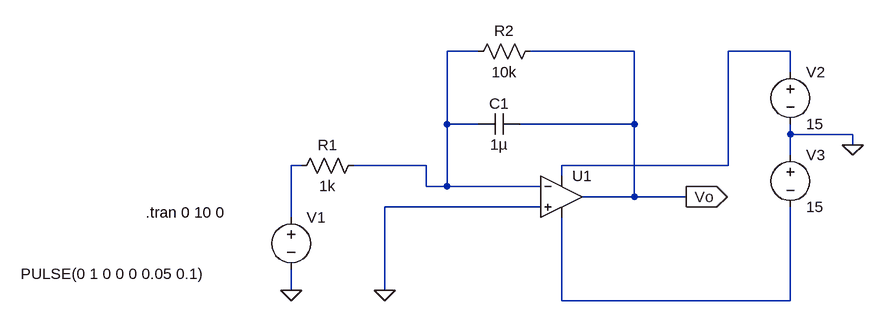
[diagram p0: schematic Integrator.asc]
Integrator.asc, the LTspice schematic file:
Version 4.1
SHEET 1 932 680
WIRE 336 -144 288 -144
WIRE 576 -144 416 -144
WIRE 816 -144 720 -144
WIRE 816 -112 816 -144
WIRE 288 -32 288 -144
WIRE 336 -32 288 -32
WIRE 576 -32 576 -144
WIRE 576 -32 400 -32
WIRE 816 -16 816 -32
WIRE 912 -16 816 -16
WIRE 912 0 912 -16
WIRE 816 16 816 -16
WIRE 64 32 48 32
WIRE 256 32 144 32
WIRE 720 32 720 -144
WIRE 720 32 464 32
WIRE 464 48 464 32
WIRE 256 64 256 32
WIRE 288 64 288 -32
WIRE 288 64 256 64
WIRE 432 64 288 64
WIRE 576 80 576 -32
WIRE 576 80 496 80
WIRE 656 80 576 80
WIRE 432 96 192 96
WIRE 48 112 48 32
WIRE 48 224 48 192
WIRE 192 224 192 96
WIRE 464 240 464 112
WIRE 816 240 816 96
WIRE 816 240 464 240
FLAG 192 224 0
FLAG 48 224 0
FLAG 656 80 Vo
IOPIN 656 80 Out
FLAG 912 0 0
SYMBOL res 160 16 R90
WINDOW 0 0 56 VBottom 2
WINDOW 3 32 56 VTop 2
SYMATTR InstName R1
SYMATTR Value 1k
SYMBOL res 432 -160 R90
WINDOW 0 0 56 VBottom 2
WINDOW 3 32 56 VTop 2
SYMATTR InstName R2
SYMATTR Value 10k
SYMBOL cap 400 -48 R90
WINDOW 0 0 32 VBottom 2
WINDOW 3 32 32 VTop 2
SYMATTR InstName C1
SYMATTR Value 1µ
SYMBOL voltage 48 96 R0
WINDOW 3 -416 103 Left 2
WINDOW 123 0 0 Left 0
WINDOW 39 0 0 Left 0
SYMATTR Value PULSE(0 1 0 0 0 0.05 0.1)
SYMATTR InstName V1
SYMBOL OpAmps\\UniversalOpAmp2 464 80 R0
SYMATTR InstName U1
SYMBOL voltage 816 -128 R0
WINDOW 123 0 0 Left 0
WINDOW 39 0 0 Left 0
SYMATTR InstName V2
SYMATTR Value 15
SYMBOL voltage 816 0 R0
WINDOW 123 0 0 Left 0
WINDOW 39 0 0 Left 0
SYMATTR InstName V3
SYMATTR Value 15
TEXT -176 104 Left 2 !.tran 0 10 0

The netlist it stands for:
* Integrator.asc
R1 N001 N003 1k
R2 Vo N001 10k
C1 Vo N001 1µ
V1 N003 0 PULSE(0 1 0 0 0 0.05 0.1)
X§U1 0 N001 N002 N004 Vo level2 Avol=1Meg GBW=10Meg Slew=10Meg Ilimit=25m Rail=0 Vos=0 En=0 Enk=0 In=0 Ink=0 Rin=500Meg  ; pins In+ In- V+ V- OUT
V2 N002 0 15
V3 0 N004 15
.tran 0 10 0
.lib UniversalOpAmp2.lib
.backanno
.end